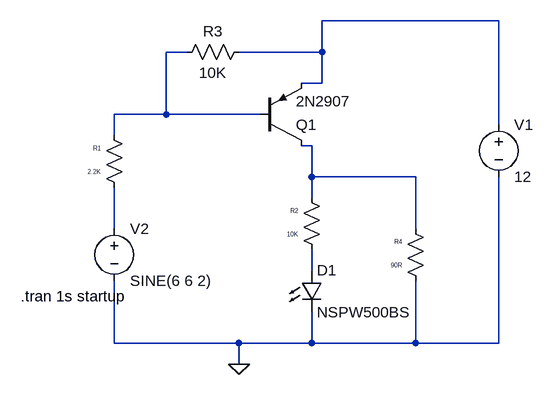
[diagram p0: schematic RelayDriver.asc]
RelayDriver.asc, the LTspice schematic file:
Version 4
SHEET 1 972 680
WIRE 912 112 640 112
WIRE 432 160 400 160
WIRE 640 160 640 112
WIRE 640 160 512 160
WIRE 640 208 640 160
WIRE 640 208 608 208
WIRE 400 256 400 160
WIRE 400 256 320 256
WIRE 544 256 400 256
WIRE 912 272 912 112
WIRE 320 288 320 256
WIRE 624 304 608 304
WIRE 624 352 624 304
WIRE 784 352 624 352
WIRE 624 384 624 352
WIRE 320 432 320 368
WIRE 784 432 784 352
WIRE 624 496 624 464
WIRE 320 608 320 512
WIRE 512 608 320 608
WIRE 624 608 624 560
WIRE 624 608 512 608
WIRE 784 608 784 512
WIRE 784 608 624 608
WIRE 912 608 912 352
WIRE 912 608 784 608
WIRE 512 640 512 608
FLAG 512 640 0
SYMBOL pnp 544 304 M180
SYMATTR InstName Q1
SYMATTR Value 2N2907
SYMBOL res 336 384 R180
WINDOW 0 36 76 Left 0
WINDOW 3 36 40 Left 0
SYMATTR InstName R1
SYMATTR Value 2.2K
SYMBOL res 640 480 R180
WINDOW 0 36 76 Left 0
WINDOW 3 36 40 Left 0
SYMATTR InstName R2
SYMATTR Value 10K
SYMBOL res 416 176 R270
WINDOW 0 32 56 VTop 2
WINDOW 3 0 56 VBottom 2
SYMATTR InstName R3
SYMATTR Value 10K
SYMBOL LED 608 496 R0
SYMATTR InstName D1
SYMATTR Value NSPW500BS
SYMBOL res 800 528 R180
WINDOW 0 36 76 Left 0
WINDOW 3 36 40 Left 0
SYMATTR InstName R4
SYMATTR Value 90R
SYMBOL voltage 912 256 R0
SYMATTR InstName V1
SYMATTR Value 12
SYMBOL voltage 320 416 R0
SYMATTR InstName V2
SYMATTR Value SINE(6 6 2)
TEXT 176 536 Left 2 !.tran 1s startup

The netlist it stands for:
* RelayDriver.asc
Q1 N003 N002 N001 0 2N2907
R1 N004 N002 2.2K
R2 N005 N003 10K
R3 N002 N001 10K
D1 N005 0 NSPW500BS
R4 0 N003 90R
V1 N001 0 12
V2 N004 0 SINE(6 6 2)
.model D D
.lib standard.dio
.model NPN NPN
.model PNP PNP
.lib standard.bjt
.tran 1s startup
.backanno
.end